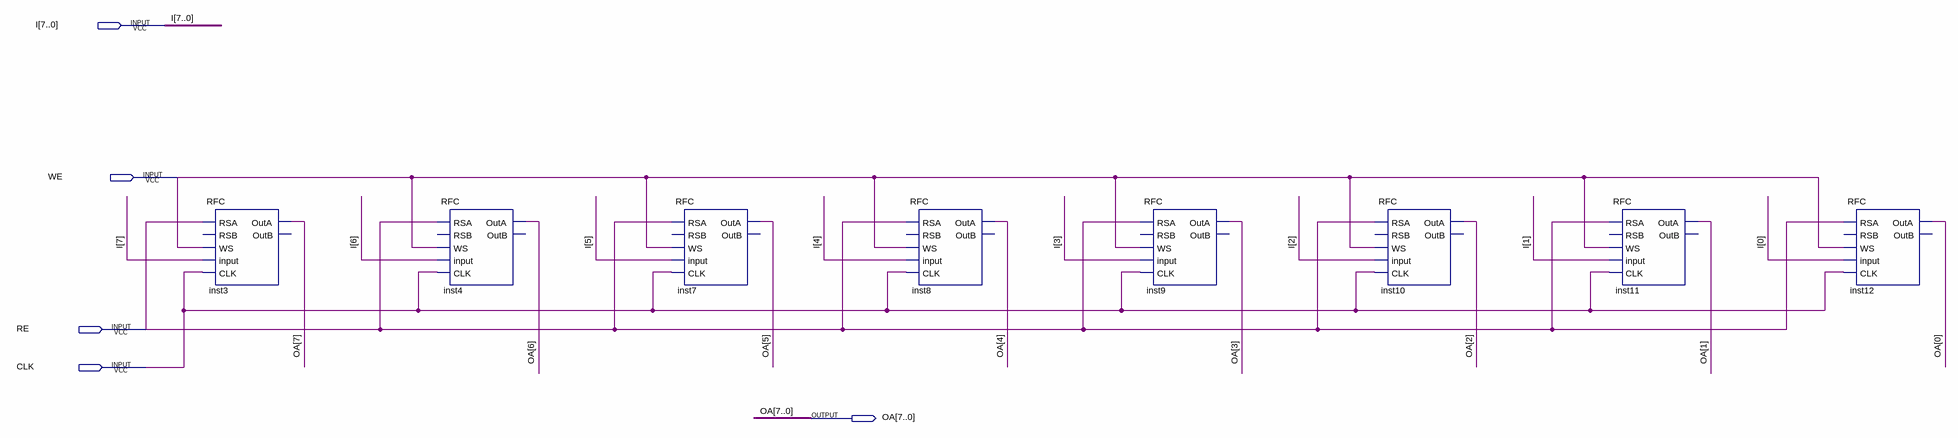
[diagram p0: schematic sheet]
// Quartus schematic Register1x8.bdf as structural Verilog: 8 symbols, 5 pins
module Register1x8 (
  input  [7:0] I,
  input  WE,
  input  RE,
  input  CLK,
  output [7:0] OA
);

  RFC inst3 (.RSA(RE), .WS(WE), .\input (I[7]), .CLK(CLK), .OutA(OA[7]));  // open: RSB, OutB
  RFC inst4 (.RSA(RE), .WS(WE), .\input (I[6]), .CLK(CLK), .OutA(OA[6]));  // open: RSB, OutB
  RFC inst7 (.RSA(RE), .WS(WE), .\input (I[5]), .CLK(CLK), .OutA(OA[5]));  // open: RSB, OutB
  RFC inst8 (.RSA(RE), .WS(WE), .\input (I[4]), .CLK(CLK), .OutA(OA[4]));  // open: RSB, OutB
  RFC inst9 (.RSA(RE), .WS(WE), .\input (I[3]), .CLK(CLK), .OutA(OA[3]));  // open: RSB, OutB
  RFC inst10 (.RSA(RE), .WS(WE), .\input (I[2]), .CLK(CLK), .OutA(OA[2]));  // open: RSB, OutB
  RFC inst11 (.RSA(RE), .WS(WE), .\input (I[1]), .CLK(CLK), .OutA(OA[1]));  // open: RSB, OutB
  RFC inst12 (.RSA(RE), .WS(WE), .\input (I[0]), .CLK(CLK), .OutA(OA[0]));  // open: RSB, OutB
endmodule
